# Altium project BMS Slave V0.1.PrjPcb (part 2 of 3)

## Sheet Temperature Sensing 8S V0.1.SchDoc
size A4; SheetNumber: 6; SheetTotal: 9
Used 2 times, as channels Temperature Sensing 8S LHS, Temperature Sensing 8S RHS. Parts and nets are listed once, with the designators drawn on the sheet.
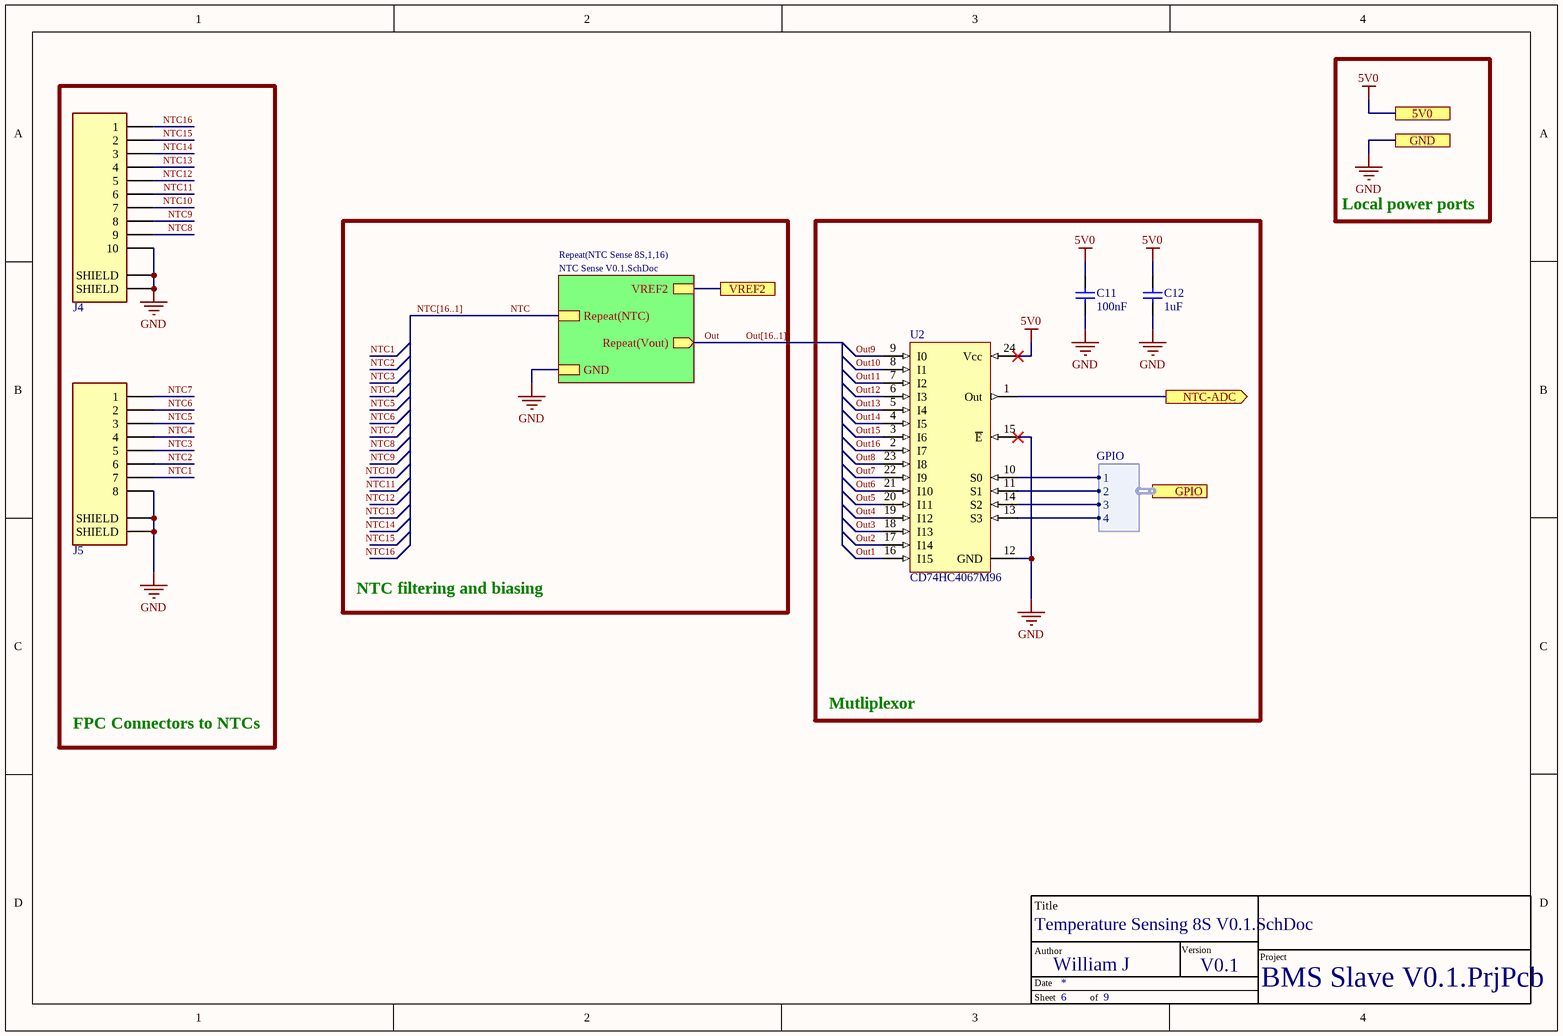
[diagram p5: Temperature Sensing 8S V0.1.SchDoc]

### Parts
*?  TitleBlock  (value not drawn)  (graphical)
C11  value 100nF  [C_0402]  (hidden comment: GRM155R62A104KE14D)
C12  value 1uF  [C_0402]  (hidden comment: EMK105BJ105KV-F)
J4  1-84953-0  [1-84953-0]  (value not drawn)
J5  84953-8  [84953-8]  (value not drawn)
U2  CD74HC4067M96  [SOIC127P1030X265-24N]

### Blocks framed on the sheet
FPC Connectors to NTCs: J4 J5
Mutliplexor: C11 C12 U2

### Sub-sheets
Repeat(NTC Sense 8S,1,16) = NTC Sense V0.1.SchDoc: VREF2, Repeat(Vout) (out), Repeat(NTC), GND

### Ports
5V0, GND, GPIO (harness GPIO), NTC-ADC (out), VREF2

### Harnesses
GPIO: 4, 3, 2, 1

### Nets
5V0: C11.1 C12.2 U2.24(Vcc) ; port 5V0
GND: C11.2 C12.1 J4.10 J4.S1(SHIELD) J4.S2(SHIELD) J5.8 J5.S1(SHIELD) J5.S2(SHIELD) U2.12(GND) U2.15(~{E}) ; port GND, sheet Repeat(NTC Sense 8S,1,16)/GND
NTC: sheet Repeat(NTC Sense 8S,1,16)/Repeat(NTC)
NTC1: J5.7  [project net NTC1_6]
NTC2: J5.6  [project net NTC2_6]
NTC3: J5.5  [project net NTC3_6]
NTC4: J5.4  [project net NTC4_6]
NTC5: J5.3  [project net NTC5_6]
NTC6: J5.2  [project net NTC6_6]
NTC7: J5.1  [project net NTC7_6]
NTC8: J4.9  [project net NTC8_6]
NTC9: J4.8  [project net NTC9_6]
NTC10: J4.7  [project net NTC10_6]
NTC11: J4.6  [project net NTC11_6]
NTC12: J4.5  [project net NTC12_6]
NTC13: J4.4  [project net NTC13_6]
NTC14: J4.3  [project net NTC14_6]
NTC15: J4.2  [project net NTC15_6]
NTC16: J4.1  [project net NTC16_6]
NTC-ADC: U2.1(Out) ; port NTC-ADC
Out: sheet Repeat(NTC Sense 8S,1,16)/Repeat(Vout)
Out1: U2.16(I15)  [project net Out1_6]
Out2: U2.17(I14)  [project net Out2_6]
Out3: U2.18(I13)  [project net Out3_6]
Out4: U2.19(I12)  [project net Out4_6]
Out5: U2.20(I11)  [project net Out5_6]
Out6: U2.21(I10)  [project net Out6_6]
Out7: U2.22(I9)  [project net Out7_6]
Out8: U2.23(I8)  [project net Out8_6]
Out9: U2.9(I0)  [project net Out9_6]
Out10: U2.8(I1)  [project net Out10_6]
Out11: U2.7(I2)  [project net Out11_6]
Out12: U2.6(I3)  [project net Out12_6]
Out13: U2.5(I4)  [project net Out13_6]
Out14: U2.4(I5)  [project net Out14_6]
Out15: U2.3(I6)  [project net Out15_6]
Out16: U2.2(I7)  [project net Out16_6]
VREF2: port VREF2, sheet Repeat(NTC Sense 8S,1,16)/VREF2
NetU2_10: U2.10(S0) ; port GPIO.1
NetU2_11: U2.11(S1) ; port GPIO.2
NetU2_13: U2.13(S3) ; port GPIO.4
NetU2_14: U2.14(S2) ; port GPIO.3

### Channels
Temperature Sensing 8S LHS: designators end in _Temperature_Sensing_8S_LHS; ports 5V0=5V0_8L GND=GND_8L NTC-ADC=NetU2_Temperature_Sensing_8S_LHS_1 VREF2=VREF8L_2
Temperature Sensing 8S RHS: designators end in _Temperature_Sensing_8S_RHS; ports 5V0=5V0_8R GND=GND_8R NTC-ADC=NetU2_Temperature_Sensing_8S_RHS_1 VREF2=VREF8R_2

### Buses and harness runs
bus NTC[16..1]
bus Out[16..1]

### Notes on the sheet
- Local power ports
- NTC filtering and biasing
- (in symbol TitleBlock) Title; Author; Version; Project; Date; Sheet; of

### Library data of the parts
C11 C12 = Capacitor: ComponentLink1Description: New link; ComponentLink1URL: *
  C11: Manufacture Part Number 1: GRM155R62A104KE14D
J4 = 1-84953-0: FPC Connectors, Flex-to-Board, 10 Position, .039 in [1 mm] Centerline, Zero Insertion Force (ZIF), Right Angle, Surface Mount
J5 = 84953-8: FPC Connectors, Flex-to-Board, 8 Position, .039 in [1 mm] Centerline, Zero Insertion Force (ZIF), Right Angle, Surface Mount; Manufacturer: TE Connectivity; Body Plating: Tin; Voltage Rating: 200V; Number of Contacts: 8; Current Rating: 1A; Gender: Female; Connector Type: Receptacle,Connector,Socket; Shielding: Unshielded; Wire/Cable Type: Flat Flex; Mating Alignment: Yes (With); PCB Mount Alignment: No (Without); PCB Mount Retention: With; Contact Location: Top; Pitch: 0.039inch; Plating Thickness: 2um; Supplier 1: RSComponents; Manufacturer Part Number: 84953-8; RoHS: Yes; Category: FFC / FPC; Stock 1: 1; Pricing 1: 10=0.83500, 200=0.65000, 750=0.58600, 3000=0.55400, 6000=0.54000 (USD); Mount: Surface Mount; Contact Material: Bronze; Contact Plating: Tin,Bright; Housing Material: Polymer; Housing Color: Natural; Color: Natural; Material: Thermoplastic; Min Operating Temperature: -40°C; Max Operating Temperature: 85°C; Termination: SMD/SMT; Package Quantity: 1500; Packaging: Tape and Reel; Number of Rows: 1; Orientation: Right Angle; Contact Current Rating: 1A; Connector System: Flex-to-Board; Number of Positions: 8; PCB Mounting Orientation: Right Angle; Sealable: No (Without); Shrouded: Yes (With); Length: 0.6268inch; Width: 0.2575inch; Height: 2.56mm; Depth: 2.56mm; Lead Pitch: 1mm; Radiation Hardening: No; REACH SVHC: No SVHC; Flammability Rating: UL94 V-0; ComponentLink1URL: https://datasheet.ciiva.com/11745/0900766b806b36e9-11745458.pdf?src-supplier=RSComponents; ComponentLink1Description: https://datasheet.ciiva.com/11745/0900766b806b36e9-11745458.pdf?src-supplier=RSComponents; ComponentLink2URL: https://datasheet.ciiva.com/669/eng-cd-84953-a3-669123.pdf?src-supplier=Digi-Key; ComponentLink2Description: https://datasheet.ciiva.com/669/eng-cd-84953-a3-669123.pdf?src-supplier=Digi-Key; ComponentLink3URL: https://datasheet.ciiva.com/669/eng-cd-84953-a3-669124.pdf?src-supplier=Digi-Key; ComponentLink3Description: https://datasheet.ciiva.com/669/eng-cd-84953-a3-669124.pdf?src-supplier=Digi-Key; ComponentLink4URL: https://datasheet.ciiva.com/14483/eng-ds-1-1773440-6-0506-14483319.pdf?src-supplier=Farnell; ComponentLink4Description: https://datasheet.ciiva.com/14483/eng-ds-1-1773440-6-0506-14483319.pdf?src-supplier=Farnell; ComponentLink5URL: https://datasheet.ciiva.com/26825/getdatasheetpartid-473787-26825575.pdf?src-supplier=Verical; ComponentLink5Description: https://datasheet.ciiva.com/26825/getdatasheetpartid-473787-26825575.pdf?src-supplier=Verical; ComponentLink6URL: https://datasheet.ciiva.com/8066/586796-8066664.pdf?src-supplier=Element14; ComponentLink6Description: https://datasheet.ciiva.com/8066/586796-8066664.pdf?src-supplier=Element14; ComponentLink7URL: https://datasheet.ciiva.com/669/eng-cd-84953-a3-669122.pdf?src-supplier=Digi-Key; ComponentLink7Description: https://datasheet.ciiva.com/669/eng-cd-84953-a3-669122.pdf?src-supplier=Digi-Key; ComponentLink8URL: https://datasheet.ciiva.com/16658/eng-ds-1-1773440-6-0506-16658613.pdf?src-supplier=Avnet+Europe; ComponentLink8Description: https://datasheet.ciiva.com/16658/eng-ds-1-1773440-6-0506-16658613.pdf?src-supplier=Avnet+Europe; ComponentLink9URL: https://datasheet.ciiva.com/8066/586796-8066666.pdf?src-supplier=Element14; ComponentLink9Description: https://datasheet.ciiva.com/8066/586796-8066666.pdf?src-supplier=Element14; ComponentLink10URL: https://datasheet.ciiva.com/30100/eng-ds-1-1773440-6-0506-30100492.pdf?src-supplier=Onlinecomponents.com; ComponentLink10Description: https://datasheet.ciiva.com/30100/eng-ds-1-1773440-6-0506-30100492.pdf?src-supplier=Onlinecomponents.com; ComponentLink11URL: https://datasheet.ciiva.com/10034/eng-ds-1-1773440-6-0506-10034351.pdf?src-supplier=Avnet; ComponentLink11Description: https://datasheet.ciiva.com/10034/eng-ds-1-1773440-6-0506-10034351.pdf?src-supplier=Avnet; Supplier Part Number 1: 5351707P
U2 = CD74HC4067M96: High-Speed CMOS Logic / 16-Channel Analog Multiplexer/Demultiplexer

## Sheet NTC Sense V0.1.SchDoc
size A4; SheetNumber: 7; SheetTotal: 9
Used 44 times, as channels Temperature Sensing 8S LHS/NTC Sense 8S1, Temperature Sensing 8S LHS/NTC Sense 8S2, Temperature Sensing 8S LHS/NTC Sense 8S3, Temperature Sensing 8S LHS/NTC Sense 8S4, Temperature Sensing 8S LHS/NTC Sense 8S5, Temperature Sensing 8S LHS/NTC Sense 8S6, Temperature Sensing 8S LHS/NTC Sense 8S7, Temperature Sensing 8S LHS/NTC Sense 8S8, Temperature Sensing 8S LHS/NTC Sense 8S9, Temperature Sensing 8S LHS/NTC Sense 8S10, Temperature Sensing 8S LHS/NTC Sense 8S11, Temperature Sensing 8S LHS/NTC Sense 8S12, Temperature Sensing 8S LHS/NTC Sense 8S13, Temperature Sensing 8S LHS/NTC Sense 8S14, Temperature Sensing 8S LHS/NTC Sense 8S15, Temperature Sensing 8S LHS/NTC Sense 8S16, Temperature Sensing 8S RHS/NTC Sense 8S1, Temperature Sensing 8S RHS/NTC Sense 8S2, Temperature Sensing 8S RHS/NTC Sense 8S3, Temperature Sensing 8S RHS/NTC Sense 8S4, Temperature Sensing 8S RHS/NTC Sense 8S5, Temperature Sensing 8S RHS/NTC Sense 8S6, Temperature Sensing 8S RHS/NTC Sense 8S7, Temperature Sensing 8S RHS/NTC Sense 8S8, Temperature Sensing 8S RHS/NTC Sense 8S9, Temperature Sensing 8S RHS/NTC Sense 8S10, Temperature Sensing 8S RHS/NTC Sense 8S11, Temperature Sensing 8S RHS/NTC Sense 8S12, Temperature Sensing 8S RHS/NTC Sense 8S13, Temperature Sensing 8S RHS/NTC Sense 8S14, Temperature Sensing 8S RHS/NTC Sense 8S15, Temperature Sensing 8S RHS/NTC Sense 8S16, Temperature Sensing 12S RHS/NTC Sense 12S1, Temperature Sensing 12S RHS/NTC Sense 12S2, Temperature Sensing 12S RHS/NTC Sense 12S3, Temperature Sensing 12S RHS/NTC Sense 12S4, Temperature Sensing 12S RHS/NTC Sense 12S5, Temperature Sensing 12S RHS/NTC Sense 12S6, Temperature Sensing 12S RHS/NTC Sense 12S7, Temperature Sensing 12S RHS/NTC Sense 12S8, Temperature Sensing 12S RHS/NTC Sense 12S9, Temperature Sensing 12S RHS/NTC Sense 12S10, Temperature Sensing 12S RHS/NTC Sense 12S11, Temperature Sensing 12S RHS/NTC Sense 12S12. Parts and nets are listed once, with the designators drawn on the sheet.
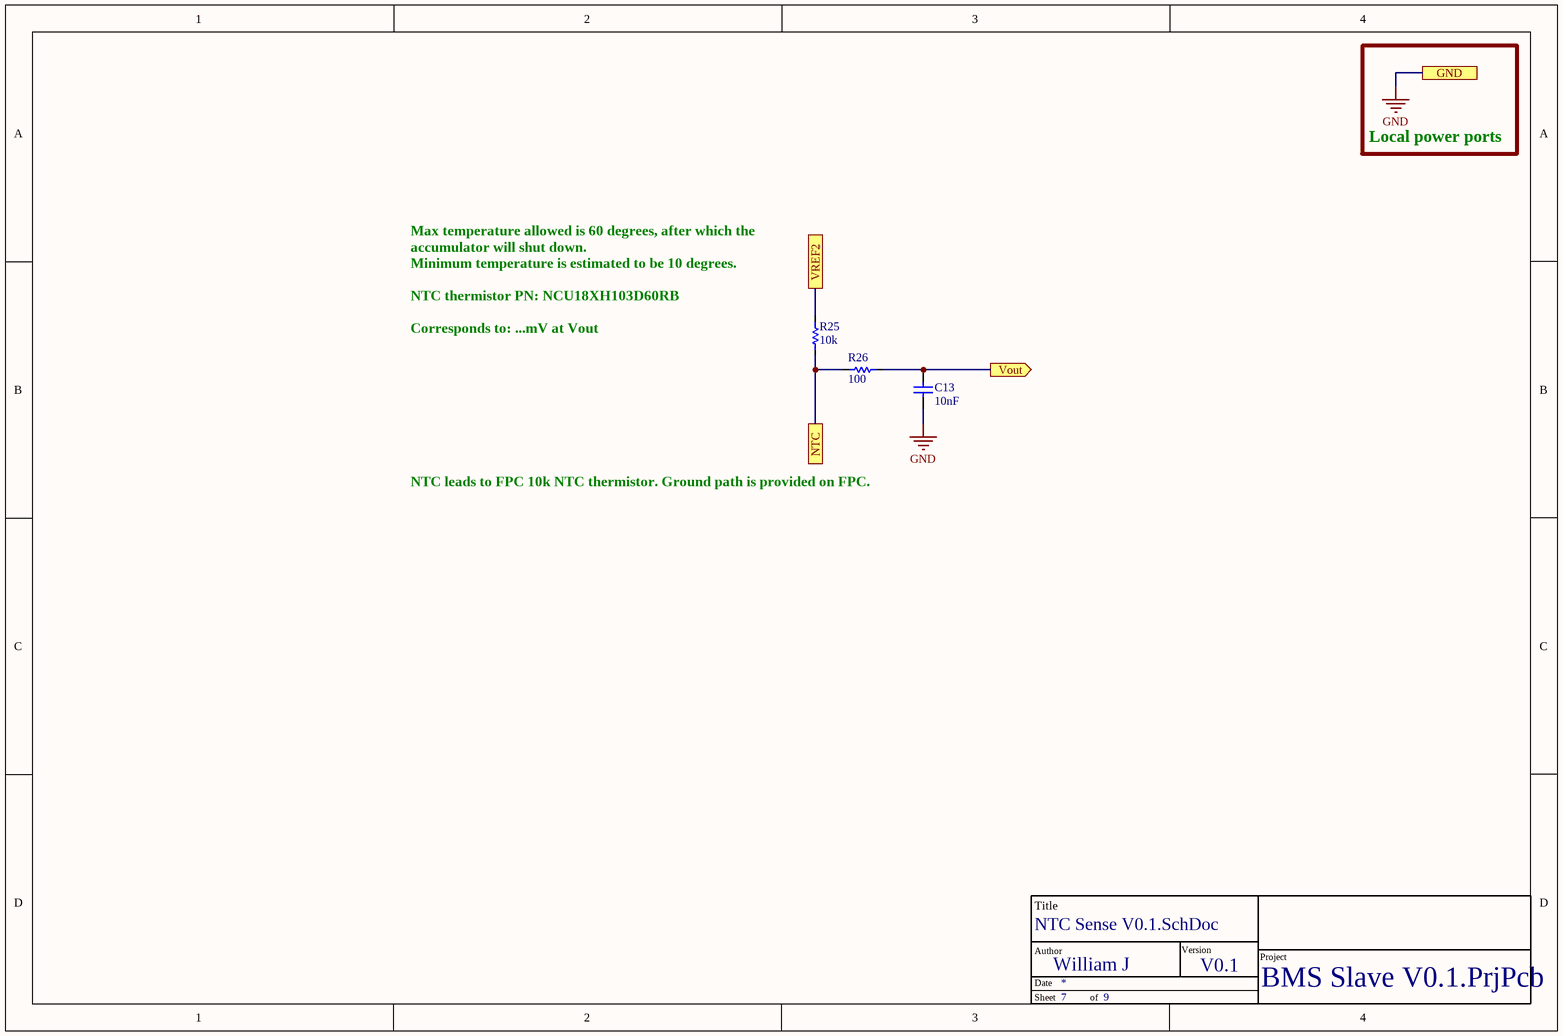
[diagram p6: NTC Sense V0.1.SchDoc]

### Parts
*  TitleBlock  (value not drawn)  (graphical)
C13  value 10nF  [C_0402]  (hidden comment: C1005X7S2A103K050BB)
R25  value 10k  [R_0402]  (hidden comment: RC0402FR-1310KL)
R26  value 100  [R_0402]  (hidden comment: RC0402FR-07100RL)

### Ports
GND, NTC, Vout (out), VREF2

### Nets
GND: C13.1 ; port GND
NTC: R25.1 R26.2 ; port NTC
Vout: C13.2 R26.1 ; port Vout
VREF2: R25.2 ; port VREF2

### Channels
Temperature Sensing 8S LHS/NTC Sense 8S1: designators end in _Temperature_Sensing_8S_LHS_NTC_Sense_8S1; ports GND=GND_8L NTC=NTC1_Temperature Sensing 8S LHS Vout=Out1_Temperature Sensing 8S LHS VREF2=VREF8L_2
Temperature Sensing 8S LHS/NTC Sense 8S2: designators end in _Temperature_Sensing_8S_LHS_NTC_Sense_8S2; ports GND=GND_8L NTC=NTC2_Temperature Sensing 8S LHS Vout=Out2_Temperature Sensing 8S LHS VREF2=VREF8L_2
Temperature Sensing 8S LHS/NTC Sense 8S3: designators end in _Temperature_Sensing_8S_LHS_NTC_Sense_8S3; ports GND=GND_8L NTC=NTC3_Temperature Sensing 8S LHS Vout=Out3_Temperature Sensing 8S LHS VREF2=VREF8L_2
Temperature Sensing 8S LHS/NTC Sense 8S4: designators end in _Temperature_Sensing_8S_LHS_NTC_Sense_8S4; ports GND=GND_8L NTC=NTC4_Temperature Sensing 8S LHS Vout=Out4_Temperature Sensing 8S LHS VREF2=VREF8L_2
Temperature Sensing 8S LHS/NTC Sense 8S5: designators end in _Temperature_Sensing_8S_LHS_NTC_Sense_8S5; ports GND=GND_8L NTC=NTC5_Temperature Sensing 8S LHS Vout=Out5_Temperature Sensing 8S LHS VREF2=VREF8L_2
Temperature Sensing 8S LHS/NTC Sense 8S6: designators end in _Temperature_Sensing_8S_LHS_NTC_Sense_8S6; ports GND=GND_8L NTC=NTC6_Temperature Sensing 8S LHS Vout=Out6_Temperature Sensing 8S LHS VREF2=VREF8L_2
Temperature Sensing 8S LHS/NTC Sense 8S7: designators end in _Temperature_Sensing_8S_LHS_NTC_Sense_8S7; ports GND=GND_8L NTC=NTC7_Temperature Sensing 8S LHS Vout=Out7_Temperature Sensing 8S LHS VREF2=VREF8L_2
Temperature Sensing 8S LHS/NTC Sense 8S8: designators end in _Temperature_Sensing_8S_LHS_NTC_Sense_8S8; ports GND=GND_8L NTC=NTC8_Temperature Sensing 8S LHS Vout=Out8_Temperature Sensing 8S LHS VREF2=VREF8L_2
Temperature Sensing 8S LHS/NTC Sense 8S9: designators end in _Temperature_Sensing_8S_LHS_NTC_Sense_8S9; ports GND=GND_8L NTC=NTC9_Temperature Sensing 8S LHS Vout=Out9_Temperature Sensing 8S LHS VREF2=VREF8L_2
Temperature Sensing 8S LHS/NTC Sense 8S10: designators end in _Temperature_Sensing_8S_LHS_NTC_Sense_8S10; ports GND=GND_8L NTC=NTC10_Temperature Sensing 8S LHS Vout=Out10_Temperature Sensing 8S LHS VREF2=VREF8L_2
Temperature Sensing 8S LHS/NTC Sense 8S11: designators end in _Temperature_Sensing_8S_LHS_NTC_Sense_8S11; ports GND=GND_8L NTC=NTC11_Temperature Sensing 8S LHS Vout=Out11_Temperature Sensing 8S LHS VREF2=VREF8L_2
Temperature Sensing 8S LHS/NTC Sense 8S12: designators end in _Temperature_Sensing_8S_LHS_NTC_Sense_8S12; ports GND=GND_8L NTC=NTC12_Temperature Sensing 8S LHS Vout=Out12_Temperature Sensing 8S LHS VREF2=VREF8L_2
Temperature Sensing 8S LHS/NTC Sense 8S13: designators end in _Temperature_Sensing_8S_LHS_NTC_Sense_8S13; ports GND=GND_8L NTC=NTC13_Temperature Sensing 8S LHS Vout=Out13_Temperature Sensing 8S LHS VREF2=VREF8L_2
Temperature Sensing 8S LHS/NTC Sense 8S14: designators end in _Temperature_Sensing_8S_LHS_NTC_Sense_8S14; ports GND=GND_8L NTC=NTC14_Temperature Sensing 8S LHS Vout=Out14_Temperature Sensing 8S LHS VREF2=VREF8L_2
Temperature Sensing 8S LHS/NTC Sense 8S15: designators end in _Temperature_Sensing_8S_LHS_NTC_Sense_8S15; ports GND=GND_8L NTC=NTC15_Temperature Sensing 8S LHS Vout=Out15_Temperature Sensing 8S LHS VREF2=VREF8L_2
Temperature Sensing 8S LHS/NTC Sense 8S16: designators end in _Temperature_Sensing_8S_LHS_NTC_Sense_8S16; ports GND=GND_8L NTC=NTC16_Temperature Sensing 8S LHS Vout=Out16_Temperature Sensing 8S LHS VREF2=VREF8L_2
Temperature Sensing 8S RHS/NTC Sense 8S1: designators end in _Temperature_Sensing_8S_RHS_NTC_Sense_8S1; ports GND=GND_8R NTC=NTC1_Temperature Sensing 8S RHS Vout=Out1_Temperature Sensing 8S RHS VREF2=VREF8R_2
Temperature Sensing 8S RHS/NTC Sense 8S2: designators end in _Temperature_Sensing_8S_RHS_NTC_Sense_8S2; ports GND=GND_8R NTC=NTC2_Temperature Sensing 8S RHS Vout=Out2_Temperature Sensing 8S RHS VREF2=VREF8R_2
Temperature Sensing 8S RHS/NTC Sense 8S3: designators end in _Temperature_Sensing_8S_RHS_NTC_Sense_8S3; ports GND=GND_8R NTC=NTC3_Temperature Sensing 8S RHS Vout=Out3_Temperature Sensing 8S RHS VREF2=VREF8R_2
Temperature Sensing 8S RHS/NTC Sense 8S4: designators end in _Temperature_Sensing_8S_RHS_NTC_Sense_8S4; ports GND=GND_8R NTC=NTC4_Temperature Sensing 8S RHS Vout=Out4_Temperature Sensing 8S RHS VREF2=VREF8R_2
Temperature Sensing 8S RHS/NTC Sense 8S5: designators end in _Temperature_Sensing_8S_RHS_NTC_Sense_8S5; ports GND=GND_8R NTC=NTC5_Temperature Sensing 8S RHS Vout=Out5_Temperature Sensing 8S RHS VREF2=VREF8R_2
Temperature Sensing 8S RHS/NTC Sense 8S6: designators end in _Temperature_Sensing_8S_RHS_NTC_Sense_8S6; ports GND=GND_8R NTC=NTC6_Temperature Sensing 8S RHS Vout=Out6_Temperature Sensing 8S RHS VREF2=VREF8R_2
Temperature Sensing 8S RHS/NTC Sense 8S7: designators end in _Temperature_Sensing_8S_RHS_NTC_Sense_8S7; ports GND=GND_8R NTC=NTC7_Temperature Sensing 8S RHS Vout=Out7_Temperature Sensing 8S RHS VREF2=VREF8R_2
Temperature Sensing 8S RHS/NTC Sense 8S8: designators end in _Temperature_Sensing_8S_RHS_NTC_Sense_8S8; ports GND=GND_8R NTC=NTC8_Temperature Sensing 8S RHS Vout=Out8_Temperature Sensing 8S RHS VREF2=VREF8R_2
Temperature Sensing 8S RHS/NTC Sense 8S9: designators end in _Temperature_Sensing_8S_RHS_NTC_Sense_8S9; ports GND=GND_8R NTC=NTC9_Temperature Sensing 8S RHS Vout=Out9_Temperature Sensing 8S RHS VREF2=VREF8R_2
Temperature Sensing 8S RHS/NTC Sense 8S10: designators end in _Temperature_Sensing_8S_RHS_NTC_Sense_8S10; ports GND=GND_8R NTC=NTC10_Temperature Sensing 8S RHS Vout=Out10_Temperature Sensing 8S RHS VREF2=VREF8R_2
Temperature Sensing 8S RHS/NTC Sense 8S11: designators end in _Temperature_Sensing_8S_RHS_NTC_Sense_8S11; ports GND=GND_8R NTC=NTC11_Temperature Sensing 8S RHS Vout=Out11_Temperature Sensing 8S RHS VREF2=VREF8R_2
Temperature Sensing 8S RHS/NTC Sense 8S12: designators end in _Temperature_Sensing_8S_RHS_NTC_Sense_8S12; ports GND=GND_8R NTC=NTC12_Temperature Sensing 8S RHS Vout=Out12_Temperature Sensing 8S RHS VREF2=VREF8R_2
Temperature Sensing 8S RHS/NTC Sense 8S13: designators end in _Temperature_Sensing_8S_RHS_NTC_Sense_8S13; ports GND=GND_8R NTC=NTC13_Temperature Sensing 8S RHS Vout=Out13_Temperature Sensing 8S RHS VREF2=VREF8R_2
Temperature Sensing 8S RHS/NTC Sense 8S14: designators end in _Temperature_Sensing_8S_RHS_NTC_Sense_8S14; ports GND=GND_8R NTC=NTC14_Temperature Sensing 8S RHS Vout=Out14_Temperature Sensing 8S RHS VREF2=VREF8R_2
Temperature Sensing 8S RHS/NTC Sense 8S15: designators end in _Temperature_Sensing_8S_RHS_NTC_Sense_8S15; ports GND=GND_8R NTC=NTC15_Temperature Sensing 8S RHS Vout=Out15_Temperature Sensing 8S RHS VREF2=VREF8R_2
Temperature Sensing 8S RHS/NTC Sense 8S16: designators end in _Temperature_Sensing_8S_RHS_NTC_Sense_8S16; ports GND=GND_8R NTC=NTC16_Temperature Sensing 8S RHS Vout=Out16_Temperature Sensing 8S RHS VREF2=VREF8R_2
Temperature Sensing 12S RHS/NTC Sense 12S1: designators end in _NTC_Sense_12S1; ports GND=GND_12 NTC=NTC1 Vout=Out1 VREF2=VREF12_2
Temperature Sensing 12S RHS/NTC Sense 12S2: designators end in _NTC_Sense_12S2; ports GND=GND_12 NTC=NTC2 Vout=Out2 VREF2=VREF12_2
Temperature Sensing 12S RHS/NTC Sense 12S3: designators end in _NTC_Sense_12S3; ports GND=GND_12 NTC=NTC3 Vout=Out3 VREF2=VREF12_2
Temperature Sensing 12S RHS/NTC Sense 12S4: designators end in _NTC_Sense_12S4; ports GND=GND_12 NTC=NTC4 Vout=Out4 VREF2=VREF12_2
Temperature Sensing 12S RHS/NTC Sense 12S5: designators end in _NTC_Sense_12S5; ports GND=GND_12 NTC=NTC5 Vout=Out5 VREF2=VREF12_2
Temperature Sensing 12S RHS/NTC Sense 12S6: designators end in _NTC_Sense_12S6; ports GND=GND_12 NTC=NTC6 Vout=Out6 VREF2=VREF12_2
Temperature Sensing 12S RHS/NTC Sense 12S7: designators end in _NTC_Sense_12S7; ports GND=GND_12 NTC=NTC7 Vout=Out7 VREF2=VREF12_2
Temperature Sensing 12S RHS/NTC Sense 12S8: designators end in _NTC_Sense_12S8; ports GND=GND_12 NTC=NTC8 Vout=Out8 VREF2=VREF12_2
Temperature Sensing 12S RHS/NTC Sense 12S9: designators end in _NTC_Sense_12S9; ports GND=GND_12 NTC=NTC9 Vout=Out9 VREF2=VREF12_2
Temperature Sensing 12S RHS/NTC Sense 12S10: designators end in _NTC_Sense_12S10; ports GND=GND_12 NTC=NTC10 Vout=Out10 VREF2=VREF12_2
Temperature Sensing 12S RHS/NTC Sense 12S11: designators end in _NTC_Sense_12S11; ports GND=GND_12 NTC=NTC11 Vout=Out11 VREF2=VREF12_2
Temperature Sensing 12S RHS/NTC Sense 12S12: designators end in _NTC_Sense_12S12; ports GND=GND_12 NTC=NTC12 Vout=Out12 VREF2=VREF12_2

### Notes on the sheet
- Local power ports
- Max temperature allowed is 60 degrees, after which the accumulator will shut down.
  Minimum temperature is estimated to be 10 degrees.
  NTC thermistor PN: NCU18XH103D60RB
  Corresponds to: ...mV at Vout
- NTC leads to FPC 10k NTC thermistor. Ground path is provided on FPC.
- (in symbol TitleBlock) Title; Author; Version; Project; Date; Sheet; of

### Library data of the parts
C13 = Capacitor: ComponentLink1Description: New link; ComponentLink1URL: *
R25 R26 = Resistor

## Sheet Cell Monitor 8S RHS V0.1.SchDoc
size A4; SheetNumber: 5; SheetTotal: 9
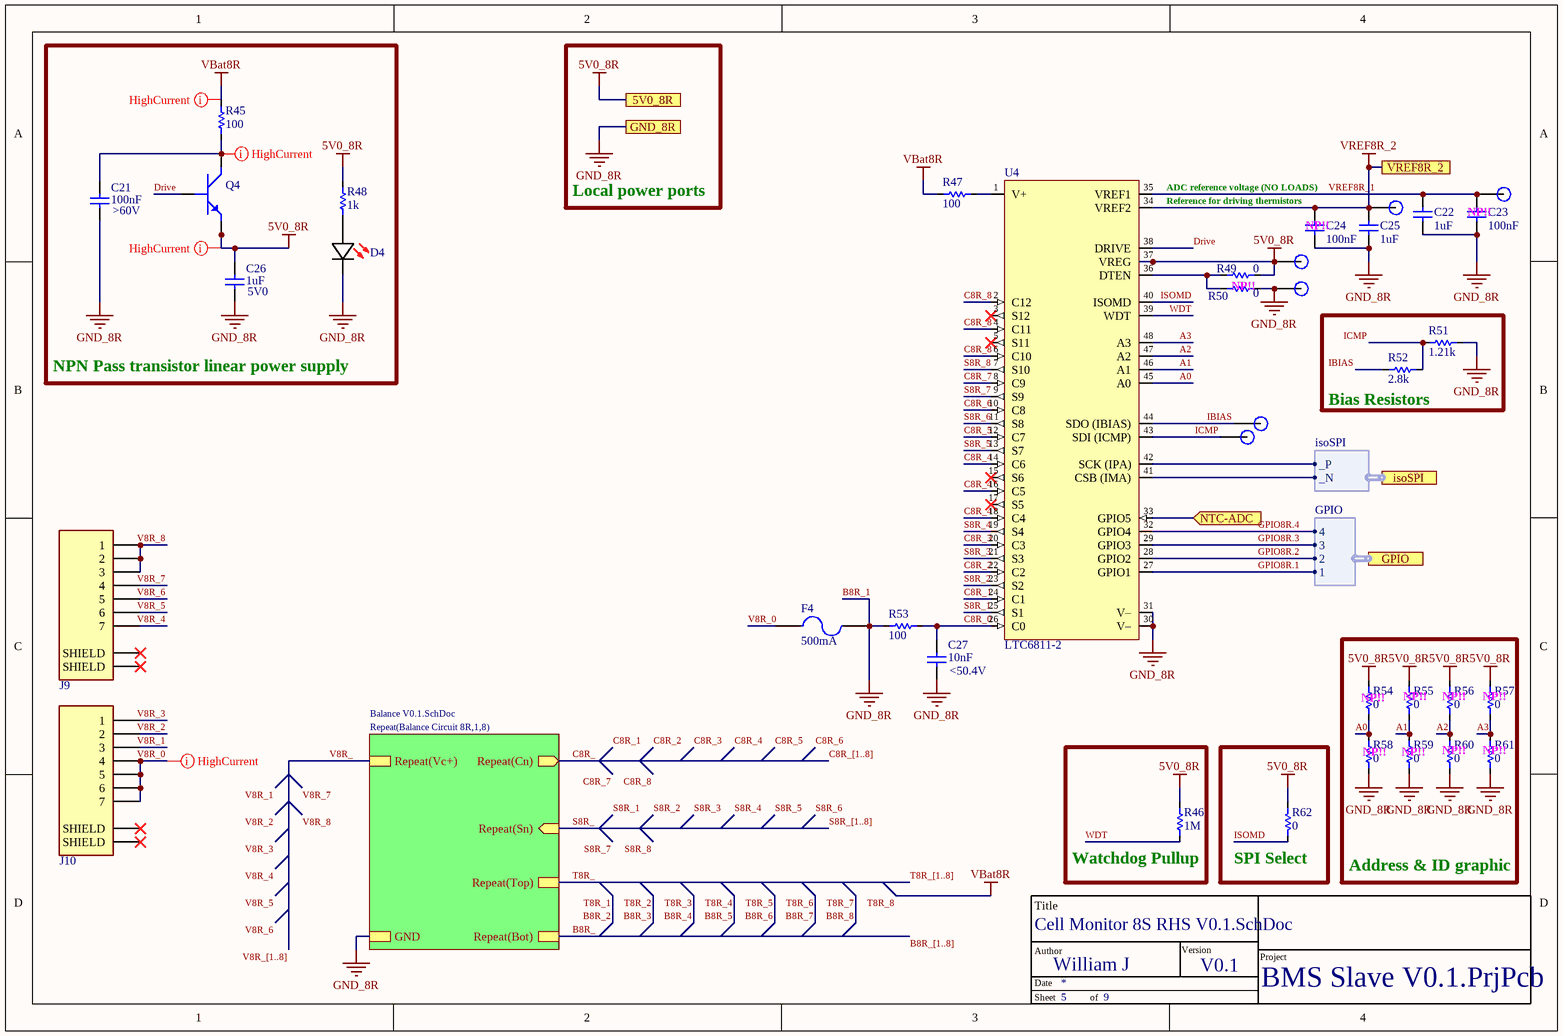
[diagram p7: Cell Monitor 8S RHS V0.1.SchDoc]

### Parts
(Parts that share a designator on the sheet are numbered #1, #2 ... from top to bottom, then left to right.)
*?#2  TitleBlock  (value not drawn)  (graphical)
C21  value 100nF  Voltage: >60V  [C_0402]  (hidden comment: GRM155R62A104KE14D)
C22  value 1uF  [C_0402]  (hidden comment: EMK105BJ105KV-F)
C23  value 100nF  [C_0402]  (hidden comment: GRM155R62A104KE14D)
C24  value 100nF  [C_0402]  (hidden comment: GRM155R62A104KE14D)
C25  value 1uF  [C_0402]  (hidden comment: EMK105BJ105KV-F)
C26  value 1uF  Voltage: 5V0  [C_0402]  (hidden comment: EMK105BJ105KV-F)
C27  value 10nF  Voltage: <50.4V  [C_0402]  (hidden comment: C1005X7S2A103K050BB)
D4  150060SS55040  [LED (0603)]  (value not drawn)
F4  Current Rating: 500mA  [0466.500NR]  (hidden comment: 0466.500NR)
J9  84953-7  [84953-7]  (value not drawn)
J10  84953-7  [84953-7]  (value not drawn)
NT5  NetTie  [NetTie]  (value not drawn)  (net tie, no BOM)
NT6  NetTie  [NetTie]  (value not drawn)  (net tie, no BOM)
Q4  PHPT60603NYX  [LFPAK56 (SOT669)]  (value not drawn)
R45  value 100  [R_2010]  (hidden comment: CRM2010-FX-1000ELF)
R46  value 1M  [R_0402]  (hidden comment: RC0402JR-071ML)
R47  value 100  [R_2010]  (hidden comment: CRM2010-FX-1000ELF)
R48  value 1k  [R_0402]  (hidden comment: RC0402FR-071KL)
R49  value 0  [R_0402]  (hidden comment: CR0402-J/-000GLF)
R50  value 0  [R_0402]  (hidden comment: CR0402-J/-000GLF)
R51  value 1.21k  [R_0402]  (hidden comment: CR0402-FX-1211GLF)
R52  value 2.8k  [R_0402]  (hidden comment: ERJ-2RKF2801X)
R53  value 100  [R_0402]  (hidden comment: RC0402FR-07100RL)
R54  value 0  [R_0402]  (hidden comment: CR0402-J/-000GLF)
R55  value 0  [R_0402]  (hidden comment: CR0402-J/-000GLF)
R56  value 0  [R_0402]  (hidden comment: CR0402-J/-000GLF)
R57  value 0  [R_0402]  (hidden comment: CR0402-J/-000GLF)
R58  value 0  [R_0402]  (hidden comment: CR0402-J/-000GLF)
R59  value 0  [R_0402]  (hidden comment: CR0402-J/-000GLF)
R60  value 0  [R_0402]  (hidden comment: CR0402-J/-000GLF)
R61  value 0  [R_0402]  (hidden comment: CR0402-J/-000GLF)
R62  value 0  [R_0402]  (hidden comment: CR0402-J/-000GLF)
TP15  VREF1  [Test Point]  (value not drawn)  (no BOM)
TP16  VREF2  [Test Point]  (value not drawn)  (no BOM)
TP17  5V0_8R  [Test Point]  (value not drawn)  (no BOM)
TP18  IBIAS  [Test Point]  (value not drawn)  (no BOM)
TP19  ICMP  [Test Point]  (value not drawn)  (no BOM)
TP20  5V0_8R  [Test Point]  (value not drawn)  (no BOM)
U4  LTC6811-2  [SSOP50P780X200-48N]

### Blocks framed on the sheet
NPN Pass transistor linear power supply: C21 C26 D4 Q4 R45 R48
Bias Resistors: R51 R52
Address & ID graphic: R54-R61
Watchdog Pullup: R46
SPI Select: R62

### Sub-sheets
Repeat(Balance Circuit 8R,1,8) = Balance V0.1.SchDoc: Repeat(Bot), Repeat(Vc+), Repeat(Top), Repeat(Cn) (out), Repeat(Sn) (in), GND

### Ports
5V0_8R, GND_8R, GPIO (harness GPIO), isoSPI (harness isoSPI), NTC-ADC (in), VREF8R_2

### Harnesses
GPIO: 1, 2, 3, 4
isoSPI: _P, _N

### Nets
5V0_8R: C26.2 Q4.1(Emitter) Q4.2(Emitter) Q4.3(Emitter) R46.2 R48.2 R49.2 R54.2 R55.2 R56.2 R57.2 R62.2 TP17.1 U4.37(VREG) ; port 5V0_8R
GND_8R: C21.1 C22.1 C23.1 C24.1 C25.1 C26.1 C27.1 D4.1(K) F4.2 NT5.1 R50.1 R51.2 R53.1 R58.1 R59.1 R60.1 R61.1 TP20.1 U4.30(V–) U4.31(V–) ; port GND_8R, sheet Repeat(Balance Circuit 8R,1,8)/GND
VBat8R: NT6.2 R45.2 R47.2
VREF8R_2: C24.2 C25.2 TP16.1 U4.34(VREF2) ; port VREF8R_2
A0: R54.1 R58.2 U4.45(A0)  [project net A0_5]
A1: R55.1 R59.2 U4.46(A1)  [project net A1_5]
A2: R56.1 R60.2 U4.47(A2)  [project net A2_5]
A3: R57.1 R61.2 U4.48(A3)  [project net A3_5]
B8R_: sheet Repeat(Balance Circuit 8R,1,8)/Repeat(Bot)
B8R_1: NT5.2
C8R_: sheet Repeat(Balance Circuit 8R,1,8)/Repeat(Cn)
C8R_0: C27.2 R53.2 U4.26(C0)  [project net C8R_0_5]
C8R_1: U4.24(C1)
C8R_2: U4.22(C2)
C8R_3: U4.20(C3)
C8R_4: U4.14(C6) U4.16(C5) U4.18(C4)
C8R_5: U4.12(C7)
C8R_6: U4.10(C8)
C8R_7: U4.8(C9)
C8R_8: U4.2(C12) U4.4(C11) U4.6(C10)
Drive: Q4.4(Base) U4.38(DRIVE)  [project net Drive_5]
GPIO8R.1: U4.27(GPIO1) ; port GPIO.1
GPIO8R.2: U4.28(GPIO2) ; port GPIO.2
GPIO8R.3: U4.29(GPIO3) ; port GPIO.3
GPIO8R.4: U4.32(GPIO4) ; port GPIO.4
IBIAS: R52.1 TP18.1 U4.44(SDO_(IBIAS))  [project net IBIAS_5]
ICMP: R51.1 R52.2 TP19.1 U4.43(SDI_(ICMP))  [project net ICMP_5]
ISOMD: R62.1 U4.40(ISOMD)  [project net ISOMD_5]
isoSPI._N: U4.41(CSB_(IMA)) ; port isoSPI._N
isoSPI._P: U4.42(SCK_(IPA)) ; port isoSPI._P
S8R_: sheet Repeat(Balance Circuit 8R,1,8)/Repeat(Sn)
S8R_1: U4.25(S1)
S8R_2: U4.23(S2)
S8R_3: U4.21(S3)
S8R_4: U4.19(S4)
S8R_5: U4.13(S7)
S8R_6: U4.11(S8)
S8R_7: U4.9(S9)
S8R_8: U4.7(S10)
T8R_: sheet Repeat(Balance Circuit 8R,1,8)/Repeat(Top)
T8R_8: NT6.1
V8R_: sheet Repeat(Balance Circuit 8R,1,8)/Repeat(Vc+)
V8R_0: F4.1 J10.4 J10.5 J10.6 J10.7  [project net V8R_0_5]
V8R_1: J10.3
V8R_2: J10.2
V8R_3: J10.1
V8R_4: J9.7
V8R_5: J9.6
V8R_6: J9.5
V8R_7: J9.4
V8R_8: J9.1 J9.2 J9.3
VREF8R_1: C22.2 C23.2 TP15.1 U4.35(VREF1)  [project net VREF8R_1_5]
WDT: R46.1 U4.39(WDT)  [project net WDT_5]
NetC21_2: C21.2 Q4.5(Collector) R45.1
NetD4_2: D4.2(A) R48.1
NetR47_1: R47.1 U4.1(V+)
NetR49_1: R49.1 R50.2 U4.36(DTEN)
NetU2_Temperature_Sensing_8S_RHS_1: U4.33(GPIO5) ; port NTC-ADC

Not connected (* = marked no-connect by the designer): J9 S1(SHIELD)* S2(SHIELD)*; J10 S1(SHIELD)* S2(SHIELD)*; U4 3(S12)* 5(S11)* 15(S6)* 17(S5)*

### Buses and harness runs
bus B8R_[1..8]
bus C8R_[1..8]
bus S8R_[1..8]
bus T8R_[1..8]
bus V8R_[1..8]

### Layout directives
net class HighCurrent; Current: >50mA: 5V0_8R, NetC21_2, V8R_0_5, VBat8R

### Notes on the sheet
- Local power ports
- ADC reference voltage (NO LOADS)
- (near C24) Reference for driving thermistors
- (near C24) NP!!
- (near C23) NP!!
- (near R50) NP!!
- (near R54) NP!!
- (near R55) NP!!
- (near R56) NP!!
- (near R57) NP!!
- (near R58) NP!!
- (near R59) NP!!
- (near R60) NP!!
- (near R61) NP!!
- Labels drawn without touching a wire or pin: C8R_1, C8R_2, C8R_3, C8R_4, C8R_5, C8R_6, C8R_7, C8R_8, S8R_1, S8R_2, S8R_3, S8R_4, S8R_5, S8R_6, S8R_7, S8R_8, V8R_1, V8R_2, V8R_3, V8R_4, V8R_5, V8R_6, V8R_7, V8R_8
- (in symbol TitleBlock) Title; Author; Version; Project; Date; Sheet; of

### Library data of the parts
C21-C27 = Capacitor: ComponentLink1Description: New link; ComponentLink1URL: *
  C21 C23 C24: Manufacture Part Number 1: GRM155R62A104KE14D
D4 = 150060SS55040: LED RED DIFFUSED 0603 SMD; Manufacturer: Wurth Electronics; Lens Style: Flat; Luminous Intensity: 70mcd; Forward Voltage: 2V; Test Current: 20mA; Viewing Angle: 140°; Dominant Wavelength: 630nm; Lens Size: 0.8mm; Supplier 1: Mouser; Manufacturer Part Number: 150060SS55040; RoHS: No; Category: LEDs; Stock 1: 17006; Pricing 1: 1=0.18000, 10=0.16800, 50=0.16800, 100=0.15200, 1000=0.12100, 10000=0.10600 (USD); Mount: Surface Mount; Case/Package: 0603; Color: Red; Case Code (Imperial): 0603; Case Code (Metric): 1608; Packaging: Tape and Reel; Lens Transparency: Diffused; Length: 1.6mm; Width: 0.8mm; Height: 0.5mm; RoHS Compliant: No; Supplier Part Number 1: 710-150060SS55040
F4 = Fuse 2: LITTELFUSE - 0466.500NR - Fuse, Surface Mount, 500 mA, 466 Series, 63 VAC, 63 VDC, Very Fast Acting, 1206; Body Material: Thermoplastic; Voltage Rating (AC): 63V; Resistance: 350mR; DC Cold Resistance: 248mR; Fuse Type: Board Mount (Cartridge Style Excluded); Approvals: UL,CSA; Published: 8-Jun-2000; LatestRevisionDate: 17-Jul-2002; LatestRevisionNote: Re-released for DXP Platform.; PackageReference: PIN-W2/E2.8; Publisher: Altium Limited; PackageDescription: Thru-Hole; 2 Leads; Supplier 1: Mouser; Supplier Part Number 1: 576-0466.500NR; Manufacturer: Littelfuse; Manufacturer Part Number: 0466.500NR; RoHS: Yes; Category: Fuses; Stock 1: 36497; Pricing 1: 1=0.77000, 10=0.59200, 50=0.59200, 100=0.48900, 1000=0.41600, 10000=0.39000 (USD); Mount: Surface Mount; Case/Package: 1206; Number of Pins: 2; Case Code (Metric): 3216; Case Code (Imperial): 1206; Housing Material: Ceramic; Terminal Material: Copper; Min Operating Temperature: -55°C; Max Operating Temperature: 90°C; Packaging: Tape and Reel; Package Quantity: 5000; Voltage Rating (DC): 63V; Series: 466; Voltage Rating: 63V; Termination: SMD/SMT; Fuse Current: 500mA; Working Voltage: 63V; Length: 3.18mm; Width: 0.06inch; Height: 0.023inch; Depth: 1.52mm; Radiation Hardening: No; RoHS Compliant: Yes; REACH SVHC: Unknown; Lead Free: Lead Free; ComponentLink1URL: https://datasheet.ciiva.com/17081/0466-500nr-17081083.pdf?src-supplier=Allied+Electronics; ComponentLink1Description: https://datasheet.ciiva.com/17081/0466-500nr-17081083.pdf?src-supplier=Allied+Electronics; ComponentLink2URL: https://datasheet.ciiva.com/16327/littelfuse-fuse-466-16327478.pdf?src-supplier=Future+Electronics; ComponentLink2Description: https://datasheet.ciiva.com/16327/littelfuse-fuse-466-16327478.pdf?src-supplier=Future+Electronics; ComponentLink3URL: https://datasheet.ciiva.com/299/466seriesdrawing-299207.pdf?src-supplier=Digi-Key; ComponentLink3Description: https://datasheet.ciiva.com/299/466seriesdrawing-299207.pdf?src-supplier=Digi-Key; ComponentLink4URL: https://datasheet.ciiva.com/299/466seriesdrawing-299208.pdf?src-supplier=Digi-Key; ComponentLink4Description: https://datasheet.ciiva.com/299/466seriesdrawing-299208.pdf?src-supplier=Digi-Key; ComponentLink5URL: https://datasheet.ciiva.com/299/466seriesdrawing-299209.pdf?src-supplier=Digi-Key; ComponentLink5Description: https://datasheet.ciiva.com/299/466seriesdrawing-299209.pdf?src-supplier=Digi-Key; ComponentLink6URL: https://datasheet.ciiva.com/14102/ei466-dat-e-14102891.pdf?src-supplier=Distrelec; ComponentLink6Description: https://datasheet.ciiva.com/14102/ei466-dat-e-14102891.pdf?src-supplier=Distrelec; ComponentLink7URL: https://datasheet.ciiva.com/15186/getdatasheetpartid-57351-15186924.pdf?src-supplier=Verical; ComponentLink7Description: https://datasheet.ciiva.com/15186/getdatasheetpartid-57351-15186924.pdf?src-supplier=Verical
J9 J10 = 84953-7: FPC Connectors, Flex-to-Board, 7 Position, .039 in [1 mm] Centerline, Zero Insertion Force (ZIF), Right Angle, Surface Mount; Manufacturer: TE Connectivity; Current Rating: 1A; Number of Contacts: 7; Shielding: Unshielded; Gender: Female; Voltage Rating: 200V; Connector Type: Receptacle,Connector,Socket; Wire/Cable Type: Flat Flex; Mating Alignment: Yes (With); PCB Mount Alignment: No (Without); PCB Mount Retention: With; Contact Location: Top; Pitch: 0.039inch; Plating Thickness: 2um; Supplier 1: Mouser; Manufacturer Part Number: 84953-7; RoHS: Yes; Category: FFC / FPC; Pricing 1: 1=0.96000, 10=0.78800, 50=0.78800, 100=0.68800, 500=0.59100, 1000=0.52600, 1500=0.47600, 4500=0.45900, 9000=0.43600, 10000=0.43600, 24000=0.42600 (USD); Mount: Surface Mount; Contact Material: Bronze; Contact Plating: Tin,Bright; Housing Color: Natural; Housing Material: Polymer; Min Operating Temperature: -40°C; Max Operating Temperature: 85°C; Termination: SMD/SMT; Package Quantity: 1500; Number of Rows: 1; Packaging: Tape and Reel; Orientation: Right Angle; Number of Positions: 7; Connector System: Flex-to-Board; PCB Mounting Orientation: Right Angle; Sealable: No (Without); Shrouded: Yes (With); Contact Current Rating: 1A; Max Voltage Rating (AC): 200V; Series: FPC; Length: 0.5866inch; Width: 0.2575inch; Height: 2.56mm; Depth: 7.3mm; Radiation Hardening: No; ELV: Compliant; REACH SVHC: Unknown; Flammability Rating: UL94 V-0; RoHS Compliant: Yes; ComponentLink1URL: https://datasheet.ciiva.com/669/eng-cd-84953-a3-669227.pdf?src-supplier=Digi-Key; ComponentLink1Description: https://datasheet.ciiva.com/669/eng-cd-84953-a3-669227.pdf?src-supplier=Digi-Key; ComponentLink2URL: https://datasheet.ciiva.com/669/eng-cd-84953-a3-669228.pdf?src-supplier=Digi-Key; ComponentLink2Description: https://datasheet.ciiva.com/669/eng-cd-84953-a3-669228.pdf?src-supplier=Digi-Key; ComponentLink3URL: https://datasheet.ciiva.com/30243/eng-ds-1-1773440-6-0506-30243340.pdf?src-supplier=Onlinecomponents.com; ComponentLink3Description: https://datasheet.ciiva.com/30243/eng-ds-1-1773440-6-0506-30243340.pdf?src-supplier=Onlinecomponents.com; ComponentLink4URL: https://datasheet.ciiva.com/16659/eng-ds-1-1773440-6-0506-16659033.pdf?src-supplier=Avnet+Europe; ComponentLink4Description: https://datasheet.ciiva.com/16659/eng-ds-1-1773440-6-0506-16659033.pdf?src-supplier=Avnet+Europe; ComponentLink5URL: https://datasheet.ciiva.com/669/eng-cd-84953-a3-669226.pdf?src-supplier=Digi-Key; ComponentLink5Description: https://datasheet.ciiva.com/669/eng-cd-84953-a3-669226.pdf?src-supplier=Digi-Key; ComponentLink6URL: https://datasheet.ciiva.com/15177/getdatasheetpartid-565061-15177031.pdf?src-supplier=Verical; ComponentLink6Description: https://datasheet.ciiva.com/15177/getdatasheetpartid-565061-15177031.pdf?src-supplier=Verical; ComponentLink7URL: https://datasheet.ciiva.com/10034/eng-ds-1-1773440-6-0506-10034350.pdf?src-supplier=Avnet; ComponentLink7Description: https://datasheet.ciiva.com/10034/eng-ds-1-1773440-6-0506-10034350.pdf?src-supplier=Avnet; Supplier Part Number 1: 571-84953-7
Q4 = PHPT60603NYX: 60V, 3 A NPN high power bipolar transistor
R45-R62 = Resistor
TP15-TP20 = Test Point: 1.2mm Test point
U4 = LTC6811-2: 12 Channel Multicell Battery Monitor with Addressable Interface

## Sheet Temperature Sensing 12S V0.1.SchDoc
size A4; SheetNumber: 8; SheetTotal: 9
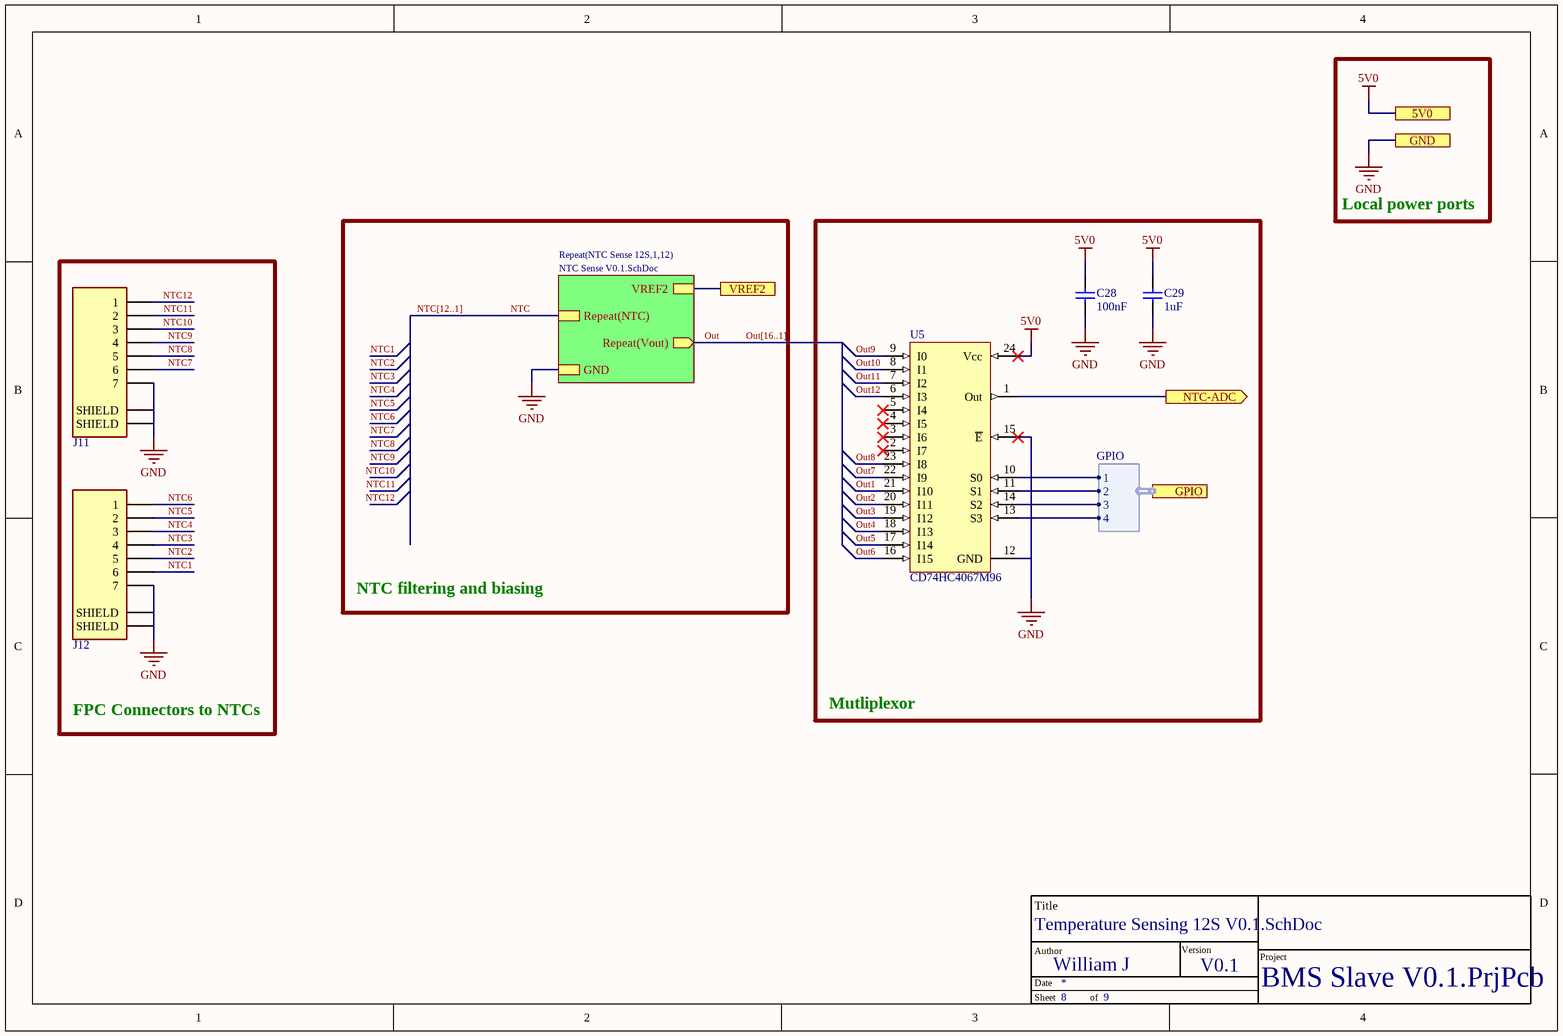
[diagram p8: Temperature Sensing 12S V0.1.SchDoc]

### Parts
(Parts that share a designator on the sheet are numbered #1, #2 ... from top to bottom, then left to right.)
*?#3  TitleBlock  (value not drawn)  (graphical)
C28  value 100nF  [C_0402]  (hidden comment: GRM155R62A104KE14D)
C29  value 1uF  [C_0402]  (hidden comment: EMK105BJ105KV-F)
J11  84953-7  [84953-7]  (value not drawn)
J12  84953-7  [84953-7]  (value not drawn)
U5  CD74HC4067M96  [SOIC127P1030X265-24N]

### Blocks framed on the sheet
Mutliplexor: C28 C29 U5
FPC Connectors to NTCs: J11 J12

### Sub-sheets
Repeat(NTC Sense 12S,1,12) = NTC Sense V0.1.SchDoc: VREF2, Repeat(Vout) (out), Repeat(NTC), GND

### Ports
5V0, GND, GPIO (harness GPIO), NTC-ADC (out), VREF2

### Harnesses
GPIO: 4, 3, 2, 1

### Nets
5V0: C28.1 C29.2 U5.24(Vcc) ; port 5V0  [project net 5V0_12]
GND: C28.2 C29.1 J11.7 J11.S1(SHIELD) J11.S2(SHIELD) J12.7 J12.S1(SHIELD) J12.S2(SHIELD) U5.12(GND) U5.15(~{E}) ; port GND, sheet Repeat(NTC Sense 12S,1,12)/GND  [project net GND_12]
VREF12_2: port VREF2, sheet Repeat(NTC Sense 12S,1,12)/VREF2
GPIO12.1: U5.10(S0) ; port GPIO.1
GPIO12.2: U5.11(S1) ; port GPIO.2
GPIO12.3: U5.14(S2) ; port GPIO.3
GPIO12.4: U5.13(S3) ; port GPIO.4
NTC: sheet Repeat(NTC Sense 12S,1,12)/Repeat(NTC)
NTC1: J12.6
NTC2: J12.5
NTC3: J12.4
NTC4: J12.3
NTC5: J12.2
NTC6: J12.1
NTC7: J11.6
NTC8: J11.5
NTC9: J11.4
NTC10: J11.3
NTC11: J11.2
NTC12: J11.1
Out: sheet Repeat(NTC Sense 12S,1,12)/Repeat(Vout)
Out1: U5.21(I10)
Out2: U5.20(I11)
Out3: U5.19(I12)
Out4: U5.18(I13)
Out5: U5.17(I14)
Out6: U5.16(I15)
Out7: U5.22(I9)
Out8: U5.23(I8)
Out9: U5.9(I0)
Out10: U5.8(I1)
Out11: U5.7(I2)
Out12: U5.6(I3)
NetU1_33: U5.1(Out) ; port NTC-ADC

Not connected (* = marked no-connect by the designer): U5 2(I7)* 3(I6)* 4(I5)* 5(I4)*

### Buses and harness runs
bus NTC[12..1]
bus Out[16..1]

### Notes on the sheet
- Local power ports
- NTC filtering and biasing
- (in symbol TitleBlock) Title; Author; Version; Project; Date; Sheet; of

### Library data of the parts
C28 C29 = Capacitor: ComponentLink1Description: New link; ComponentLink1URL: *
  C28: Manufacture Part Number 1: GRM155R62A104KE14D
J11 J12 = 84953-7: as J9 on sheet Cell Monitor 8S RHS V0.1; Supplier 1: Mouser; Manufacturer Part Number: 84953-7; RoHS: Yes; Category: FFC / FPC; Pricing 1: 1=0.96000, 10=0.78800, 50=0.78800, 100=0.68800, 500=0.59100, 1000=0.52600, 1500=0.47600, 4500=0.45900, 9000=0.43600, 10000=0.43600, 24000=0.42600 (USD); Mount: Surface Mount; Contact Material: Bronze; Contact Plating: Tin,Bright; Housing Color: Natural; Housing Material: Polymer; Min Operating Temperature: -40°C; Max Operating Temperature: 85°C; Termination: SMD/SMT; Package Quantity: 1500; Number of Rows: 1; Packaging: Tape and Reel; Orientation: Right Angle; Number of Positions: 7; Connector System: Flex-to-Board; PCB Mounting Orientation: Right Angle; Sealable: No (Without); Shrouded: Yes (With); Contact Current Rating: 1A; Max Voltage Rating (AC): 200V; Series: FPC; Length: 0.5866inch; Width: 0.2575inch; Height: 2.56mm; Depth: 7.3mm; Radiation Hardening: No; ELV: Compliant; REACH SVHC: Unknown; Flammability Rating: UL94 V-0; RoHS Compliant: Yes; ComponentLink1URL: https://datasheet.ciiva.com/669/eng-cd-84953-a3-669227.pdf?src-supplier=Digi-Key; ComponentLink1Description: https://datasheet.ciiva.com/669/eng-cd-84953-a3-669227.pdf?src-supplier=Digi-Key; ComponentLink2URL: https://datasheet.ciiva.com/669/eng-cd-84953-a3-669228.pdf?src-supplier=Digi-Key; ComponentLink2Description: https://datasheet.ciiva.com/669/eng-cd-84953-a3-669228.pdf?src-supplier=Digi-Key; ComponentLink3URL: https://datasheet.ciiva.com/30243/eng-ds-1-1773440-6-0506-30243340.pdf?src-supplier=Onlinecomponents.com; ComponentLink3Description: https://datasheet.ciiva.com/30243/eng-ds-1-1773440-6-0506-30243340.pdf?src-supplier=Onlinecomponents.com; ComponentLink4URL: https://datasheet.ciiva.com/16659/eng-ds-1-1773440-6-0506-16659033.pdf?src-supplier=Avnet+Europe; ComponentLink4Description: https://datasheet.ciiva.com/16659/eng-ds-1-1773440-6-0506-16659033.pdf?src-supplier=Avnet+Europe; ComponentLink5URL: https://datasheet.ciiva.com/669/eng-cd-84953-a3-669226.pdf?src-supplier=Digi-Key; ComponentLink5Description: https://datasheet.ciiva.com/669/eng-cd-84953-a3-669226.pdf?src-supplier=Digi-Key; ComponentLink6URL: https://datasheet.ciiva.com/15177/getdatasheetpartid-565061-15177031.pdf?src-supplier=Verical; ComponentLink6Description: https://datasheet.ciiva.com/15177/getdatasheetpartid-565061-15177031.pdf?src-supplier=Verical; ComponentLink7URL: https://datasheet.ciiva.com/10034/eng-ds-1-1773440-6-0506-10034350.pdf?src-supplier=Avnet; ComponentLink7Description: https://datasheet.ciiva.com/10034/eng-ds-1-1773440-6-0506-10034350.pdf?src-supplier=Avnet; Supplier Part Number 1: 571-84953-7
U5 = CD74HC4067M96: High-Speed CMOS Logic / 16-Channel Analog Multiplexer/Demultiplexer